# EAGLE design openhum3 (EAGLE 6.5.0)
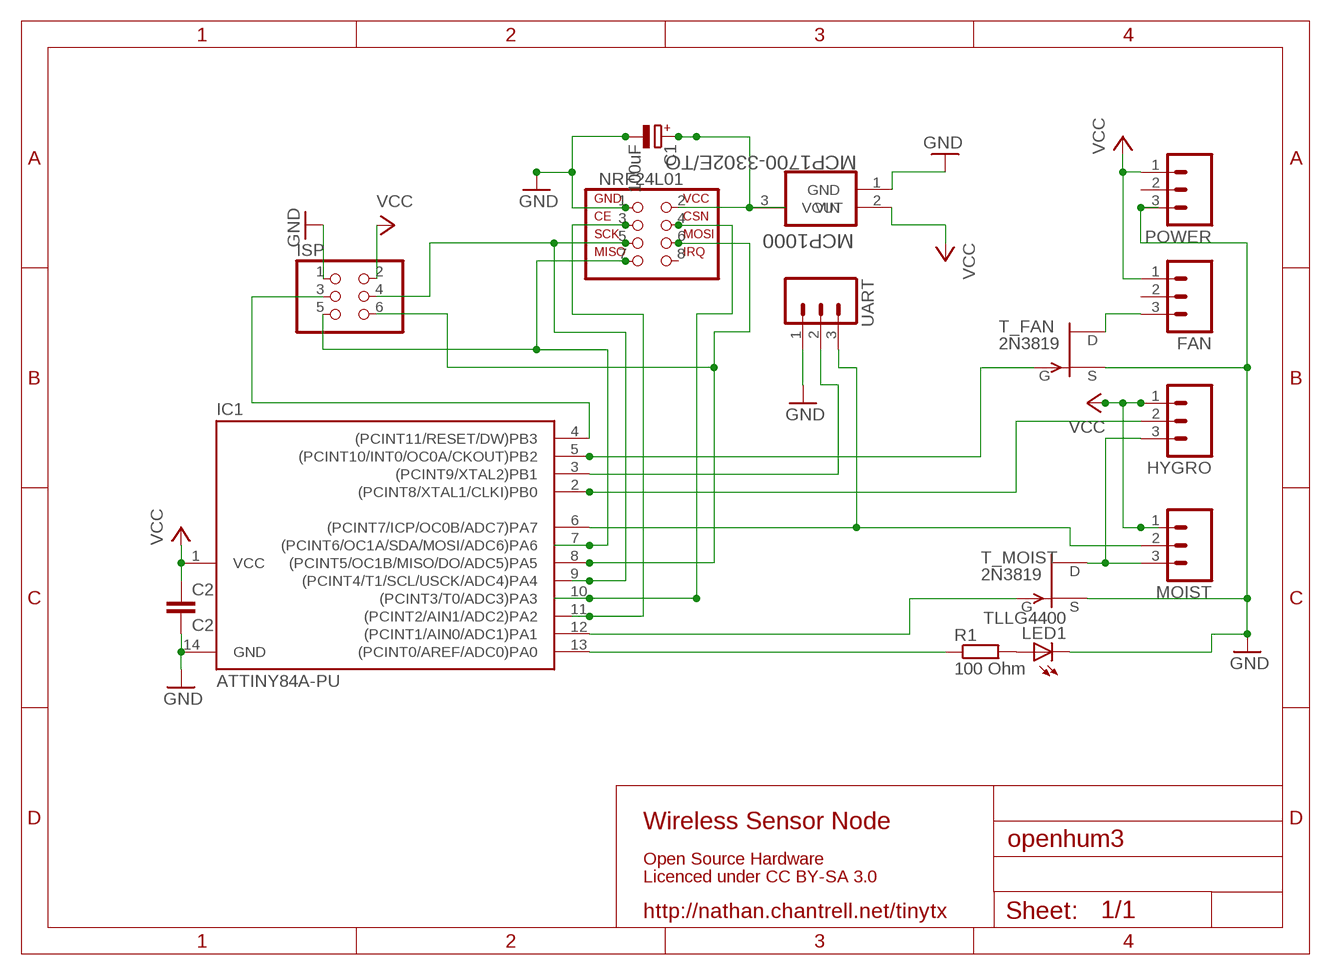
[diagram p0: schematic, sheet 1]

## Parts
C1  100uF  CPOL-EUE2.5-6  [E2,5-6]
C2  C2  C-EU025-025X050  [C025-025X050]
FAN  M03JST-PTH  [JST-3-PTH]
HYGRO  M03JST-PTH  [JST-3-PTH]
IC1  ATTINY84A-PU  TINY24/44/84-PU  [DIL14]
ISP  PINHD-2X3  [2X03]
LED1  TLLG4400  [LED3MM]
MCP1000  MCP1700-3302E/TO  [TO127P254X495-3]
MOIST  M03JST-PTH  [JST-3-PTH]
NRF24L01  NRF24L01+  [NRF24L01+]
POWER  M03JST-PTH  [JST-3-PTH]
R1  100 Ohm  R-EU_0204/5  [0204/5]
T_FAN  2N3819  [TO92]
T_MOIST  2N3819  [TO92]
UART  M03JST-PTH  [JST-3-PTH]

## Nets
GND: C1.- C2.2 IC1.14(GND) ISP.1 LED1.K(C) MCP1000.1(GND) NRF24L01.1 POWER.3 T_FAN.3(S) T_MOIST.3(S) UART.1
N$1: IC1.11((PCINT2/AIN1/ADC2)PA2) NRF24L01.3
N$2: IC1.10((PCINT3/T0/ADC3)PA3) NRF24L01.4
N$3: IC1.9((PCINT4/T1/SCL/USCK/ADC4)PA4) ISP.4 NRF24L01.5
N$4: IC1.7((PCINT6/OC1A/SDA/MOSI/ADC6)PA6) ISP.5 NRF24L01.7
N$5: FAN.3 T_FAN.1(D)
N$6: IC1.5((PCINT10/INT0/OC0A/CKOUT)PB2) T_FAN.2(G)
N$7: IC1.3((PCINT9/XTAL2)PB1) UART.2
N$8: C1.+ MCP1000.3(VOUT) NRF24L01.2
N$9: IC1.12((PCINT1/AIN0/ADC1)PA1) T_MOIST.2(G)
N$10: IC1.13((PCINT0/AREF/ADC0)PA0) R1.1
N$11: IC1.8((PCINT5/OC1B/MISO/DO/ADC5)PA5) ISP.6 NRF24L01.6
N$12: HYGRO.2 IC1.2((PCINT8/XTAL1/CLKI)PB0)
N$13: IC1.4((PCINT11/RESET/DW)PB3) ISP.3
N$14: HYGRO.3 MOIST.3 T_MOIST.1(D)
N$15: IC1.6((PCINT7/ICP/OC0B/ADC7)PA7) MOIST.2 UART.3
N$16: LED1.A R1.2
VCC: C2.1 FAN.1 HYGRO.1 IC1.1(VCC) ISP.2 MCP1000.2(VIN) MOIST.1 POWER.1
Unconnected: FAN.2 NRF24L01.8 POWER.2

## Notes on the sheet
- Wireless Sensor Node
- Open Source Hardware
- Licenced under CC BY-SA 3.0
- http://nathan.chantrell.net/tinytx

## Library data of the parts
C1 = resistor:CPOL-EU: POLARIZED CAPACITOR, European symbol
C2 = rcl:C-EU: CAPACITOR, European symbol
FAN HYGRO MOIST POWER UART = SparkFun-Connectors:M03: Header 3 Standard 3-pin 0.1" header. Use with straight break away headers (SKU : PRT-00116), right angle break away headers (PRT-00553), swiss pins (PRT-00743), machine pins (PRT-00117), and female headers (PRT-00115). Molex polarized connector foot print use with SKU : PRT-08232 with associated crimp pins and housings.; SKU: PRT-09915
IC1 = avr-5:TINY24/44/84
ISP = pinhead:PINHD-2X3: PIN HEADER
LED1 = led:TLLG4400: Low Current (2mA) LED 3 mm Tinted Diffused Package color GREEN Source: Data sheet <http://www.farnell.com/datasheets/391098.pdf>; MF: VISHAY SEMICONDUCTOR; OC_FARNELL: 1612435
MCP1000 = linear:MCP1700-3302E/TO: IC, Low Quiescent Current LDO,3.3V,TO-92; MPN: MCP1700-3302E/TO; OC_FARNELL: 1296588; OC_NEWARK: 88H9804; PACKAGE: TO-92; SUPPLIER: Microchip
NRF24L01 = MTS_Custom:NRF24L01+
R1 = resistor:R-EU_: RESISTOR, European symbol
T_FAN T_MOIST = transistor-fet:2N3819: N-Channel Junction FET

## Net classes
1 power: width 0.6 mm, clearance 0.3 mm

## Board
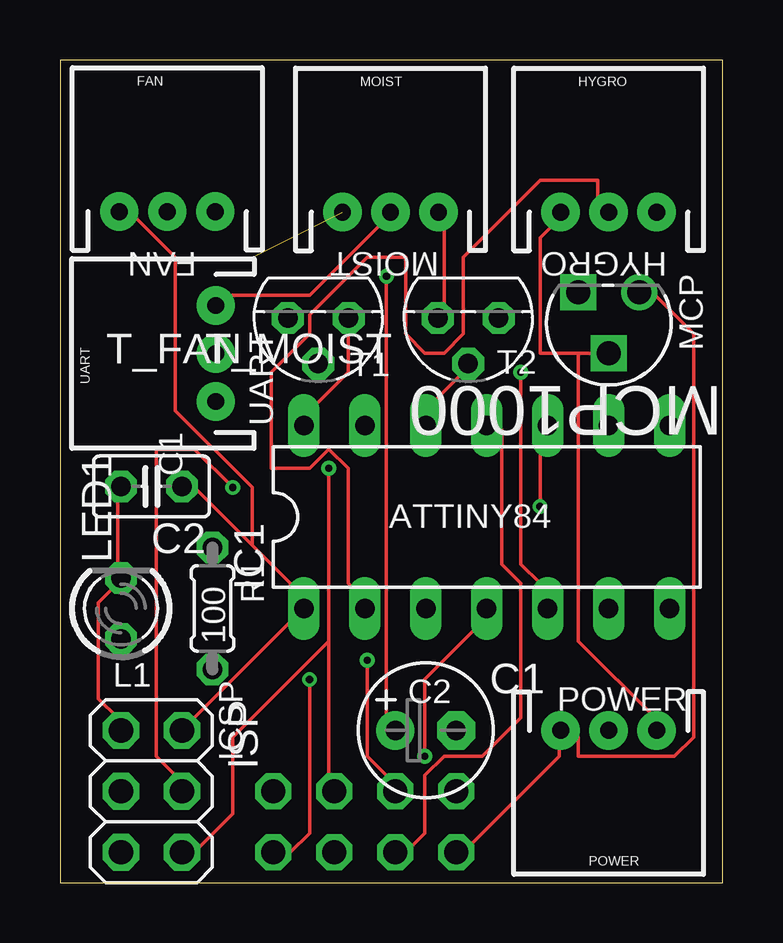
[diagram p1: board, top side]
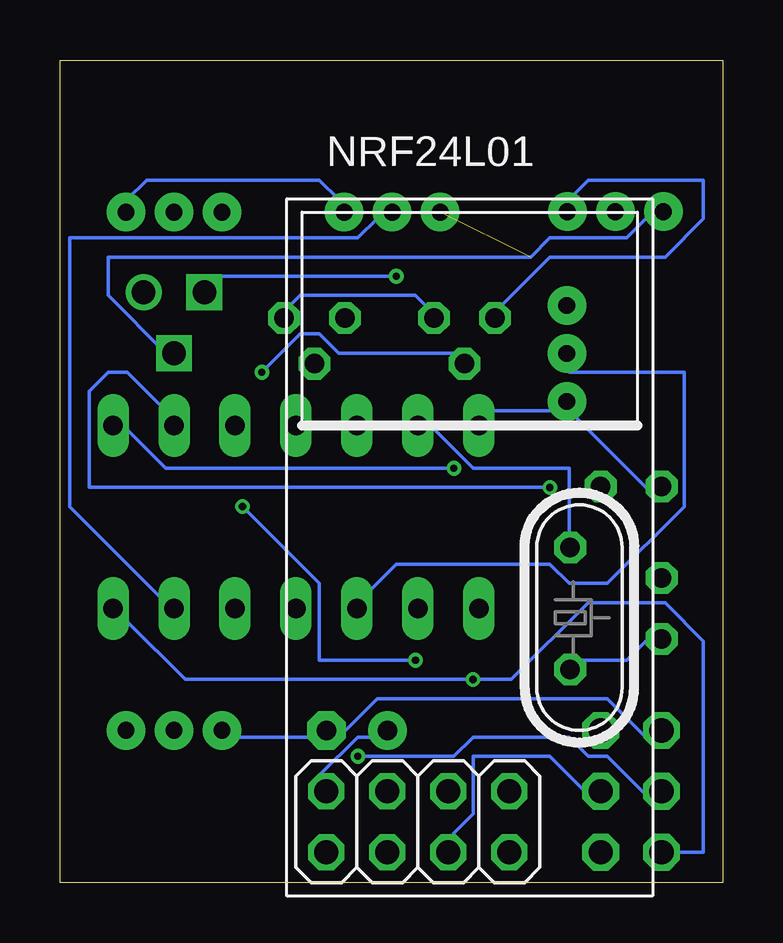
[diagram p2: board, bottom side, seen from below]

Size 27.61 x 34.28 mm. Coordinates in mm from the lower left corner, seen from the top.
Outline: 0,0 27.61,0 27.61,34.28 0,34.28 0,0
Copper layers (1*16): Top 0.035mm / dielectric 1.5mm / Bottom 0.035mm
Design rules "SeeedStudio_2layer_DRU_no_angle_20140221": minimum track width 6mil, minimum drill 12mil, track to track 6mil, track to pad 6mil, pad to pad 6mil, via to via 6mil, smd to smd 0mil, copper to edge 10mil, drill to drill 10mil, minimum pad ring 10mil, minimum via ring 6mil, stop-mask expansion 2mil, vias tented up to drill 100mil, thermal gap 10mil

### Footprints (pad centres in the part's own frame; a part is rotated, then mirrored left to right if it is on the bottom)
E2,5-6 = drill 0.813 pad 1.6: + -1.27,0 | drill 0.813 pad 1.6 octagon: - 1.27,0
C025-025X050 = drill 0.813 octagon: 1 -1.27,0; 2 1.27,0
JST-3-PTH = drill 0.7 pad 1.6: 1 -2,0; 2 0,0; 3 2,0
DIL14 = drill 0.813 long: 1 -7.62,-3.81; 2 -5.08,-3.81; 3 -2.54,-3.81; 4 0,-3.81; 5 2.54,-3.81; 6 5.08,-3.81; 7 7.62,-3.81; 8 7.62,3.81; 9 5.08,3.81; 10 2.54,3.81; 11 0,3.81; 12 -2.54,3.81; 13 -5.08,3.81; 14 -7.62,3.81
2X03 = drill 1.016 octagon: 1 -2.54,-1.27; 2 -2.54,1.27; 3 0,-1.27; 4 0,1.27; 5 2.54,-1.27; 6 2.54,1.27
LED3MM = drill 0.813 octagon: A -1.27,0; K 1.27,0
TO127P254X495-3 = drill 0.991: 1 -2.54,-2.54 | drill 0.991 square: 2 -1.27,0; 3 0,-2.54
NRF24L01+ = drill 1 octagon: 1 -5.08,-12.7; 2 -5.08,-10.16; 3 -2.54,-12.7; 4 -2.54,-10.16; 5 0,-12.7; 6 0,-10.16; 7 2.54,-12.7; 8 2.54,-10.16
0204/5 = drill 0.813 octagon: 1 -2.54,0; 2 2.54,0
TO92 = drill 0.813 octagon: 1 1.27,0; 2 0,1.905; 3 -1.27,0

### Placement (x,y rotation side)
C1  15.24,6.35 0 top
C2  3.81,16.51 180 top
FAN  4.47,27.96 0 top
HYGRO  22.86,27.94 0 top
IC1  17.78,15.24 0 top
ISP  3.81,3.81 270 top
LED1  2.54,11.43 90 top
MCP1000  21.59,22.06 180 top
MOIST  13.77,27.94 0 top
NRF24L01  11.43,13.97 0 bottom
POWER  22.86,6.35 180 top
R1  6.35,11.43 270 top
T_FAN  10.76,23.53 180 top
T_MOIST  17.01,23.53 180 top
UART  6.49,22.05 90 top

### Tracks (layer width: path | path; a pad name or v marks a point on that pad's centre or on a via)
GND
  Top 0.152: MCP1000.1 24.8,24.47 26.4,22.87 26.4,6.07 25.6,5.27 21.6,5.27 21.6,6.07 POWER.3 20.8,6.07 20.8,5.27 16.8,1.27 NRF24L01.1 | C2.2 2.4,16.47 2.4,13.27 LED1.K 2.4,12.47 1.6,11.67 1.6,7.67 2.4,6.87 ISP.1 | T_FAN.3 12,22.87 12,21.27 10.4,19.67 IC1.14
  Bottom 0.152: POWER.3 20.8,6.07 16.8,6.07 C1.- 16,6.07 14.4,7.67 4.8,7.67 3.2,6.07 ISP.1 | IC1.14 9.6,19.67 7.2,19.67 UART.1 6.4,19.67 3.2,16.47 C2.2 | T_MOIST.3 18.4,23.67 17.6,24.47 12.8,24.47 12,23.67 T_FAN.3
N$1
  Top 0.152: IC1.11 18.4,18.87 18.4,13.27 19.2,12.47 19.2,6.87 17.6,5.27 16,5.27 15.2,4.47 15.2,2.07 14.4,1.27 NRF24L01.3
N$2  (via drill 0.3)
  Top 0.152: v20,15.67 20,18.87 IC1.10 | v12.8,9.27 12.8,5.27 13.6,4.47 NRF24L01.4
  Bottom 0.152: v20,15.67 16.8,12.47 16.8,9.27 v12.8,9.27
N$3  (via drill 0.3)
  Top 0.152: v7.2,16.47 5.6,18.07 4,18.07 4,5.27 4.8,4.47 ISP.4
  Bottom 0.152: v7.2,16.47 26.4,16.47 26.4,20.47 25.6,21.27 24.8,21.27 23.2,19.67 IC1.9 | NRF24L01.5 11.2,1.27 11.2,2.07 10.4,2.87 10.4,5.27 7.2,5.27 5.6,3.67 ISP.4
N$4  (via drill 0.3)
  Top 0.152: v10.4,8.47 10.4,2.07 9.6,1.27 NRF24L01.7
  Bottom 0.152: ISP.5 0.8,1.27 0.8,10.07 2.4,11.67 5.6,11.67 8.8,8.47 v10.4,8.47 22.4,8.47 24.8,10.87 IC1.7
N$5
  Bottom 0.152: T_FAN.1 9.6,23.67 7.2,26.07 2.4,26.07 0.8,27.67 0.8,29.27 5.6,29.27 6.4,28.47 FAN.3
N$6  (via drill 0.3)
  Top 0.152: v19.2,21.27 19.2,13.27 20,12.47 20,11.67 IC1.5
  Bottom 0.152: v19.2,21.27 17.6,22.87 16.8,22.87 16,22.07 11.2,22.07 T_FAN.2
N$7
  Bottom 0.152: IC1.3 15.2,11.67 13.6,13.27 7.2,13.27 6.4,12.47 4.8,12.47 1.6,15.67 1.6,21.27 6.4,21.27 UART.2
N$8  (via drill 0.3)
  Top 0.152: v13.6,25.27 13.6,6.87 C1.+
  Bottom 0.152: v13.6,25.27 21.6,25.27 MCP1000.3 | NRF24L01.2 16.8,4.47 15.2,6.07 14.4,6.07 C1.+
N$9
  Top 0.152: IC1.12 15.2,19.67 16.8,21.27 T_MOIST.2
N$10
  Bottom 0.152: R1.1 6.4,14.07 6.4,17.27 10.4,17.27 12,18.87 12.8,18.87 IC1.13
N$11  (via drill 0.3)
  Top 0.152: 11.2,10.07 11.2,4.47 NRF24L01.6 | 11.2,10.07 v11.2,17.27 | 11.2,10.07 7.2,6.07 7.2,2.87 5.6,1.27 ISP.6
  Bottom 0.152: v11.2,17.27 23.2,17.27 24.8,18.87 IC1.8
N$12
  Top 0.152: IC1.2 12.8,11.67 12,12.47 12,17.27 11.2,18.07 10.4,17.27 8.8,17.27 8.8,21.27 10.4,22.87 10.4,23.67 12.8,26.07 14.4,26.07 14.4,22.87 15.2,22.07 16,22.07 16.8,22.87 16.8,26.07 20,29.27 22.4,29.27 22.4,28.47 HYGRO.2
N$13  (via drill 0.3)
  Top 0.152: v15.2,5.27 15.2,8.47 17.6,10.87 IC1.4
  Bottom 0.152: v15.2,5.27 11.2,5.27 10.4,6.07 6.4,6.07 5.6,5.27 4.8,5.27 3.2,3.67 ISP.3
N$14
  Top 0.152: T_MOIST.1 16,23.67 16,27.67 MOIST.3
  Bottom 0.152: HYGRO.3 24.8,28.47 24,29.27 16.8,29.27 16,28.47 MOIST.3
N$15
  Top 0.152: UART.3 7.2,24.47 10.4,24.47 13.6,27.67 MOIST.2
  Bottom 0.152: IC1.6 23.2,11.67 27.2,15.67 27.2,26.87 15.2,26.87 14.4,27.67 MOIST.2
N$16
  Bottom 0.152: LED1.A 3.2,10.07 4,9.27 6.4,9.27 R1.2
VCC  (1 unrouted)
  Top 0.152: 21.6,22.07 20,22.07 20,26.87 20.8,27.67 HYGRO.1 | 21.6,22.07 22.4,22.07 MCP1000.2 | 21.6,22.07 21.6,10.07 24.8,6.87 POWER.1 | 8,14.07 9.6,12.47 9.6,11.67 IC1.1 ISP.2 | 8,14.07 5.6,16.47 C2.1 | 8,14.07 8,16.47 4.8,19.67 4.8,26.07 3.2,27.67 FAN.1
  Bottom 0.152: MCP1000.2 23.2,22.07 25.6,24.47 25.6,26.07 8,26.07 7.2,26.87 4,26.87 3.2,27.67 FAN.1

### Text on the board
tSilk: L1
_tsilk: FAN | MOIST | HYGRO | MCP | T1 | T2 | C1 | UART | ATTINY84 | 100 | L1 | C2 | POWER | ICSP